# EAGLE schematic untitled (EAGLE 7.6.0)
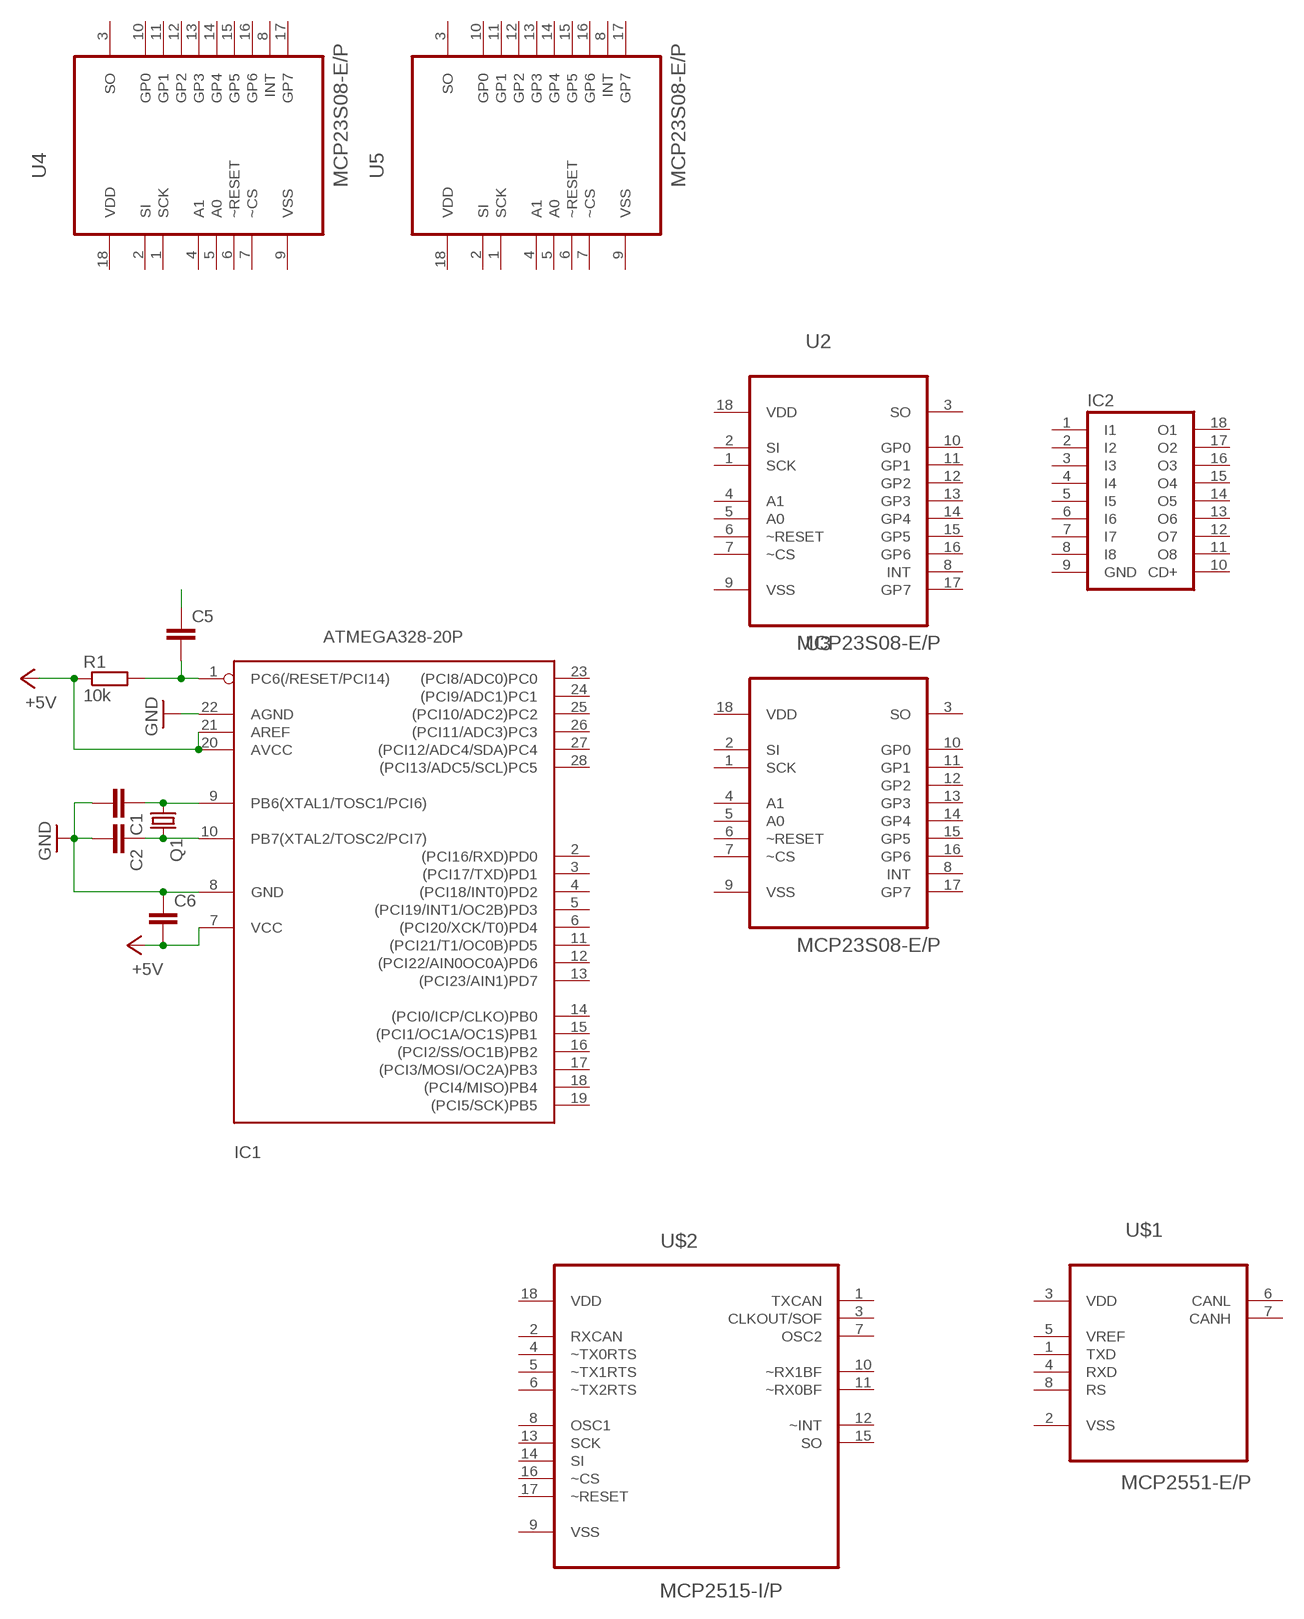
[diagram p0: schematic, sheet 1]

## Parts
C1  C5/3  [C5B3]
C2  C5/3  [C5B3]
C5  C5/3  [C5B3]
C6  C5/3  [C5B3]
IC1  ATMEGA328-20P  [DIL28-3]
IC2  ULN2803A  [DIL18]
Q1  CRYSTALHC18U-V  [HC18U-V]
R1  10k  R-EU_0207/12  [0207/12]
U2  MCP23S08-E/P  [DIP254P762X432-18]
U3  MCP23S08-E/P  [DIP254P762X432-18]
U4  MCP23S08-E/P  [DIP254P762X432-18]
U5  MCP23S08-E/P  [DIP254P762X432-18]
U$1  MCP2551-E/P  [DIP254P762X432-8]
U$2  MCP2515-I/P  [DIP254P762X432-18]

## Nets
+5V: C6.2 IC1.7(VCC) IC1.20(AVCC) IC1.21(AREF) R1.1
GND: C1.2 C2.2 C6.1 IC1.8(GND) IC1.22(AGND)
N$1: C1.1 IC1.9(PB6(XTAL1/TOSC1/PCI6)) Q1.1
N$2: C2.1 IC1.10(PB7(XTAL2/TOSC2/PCI7)) Q1.2
N$17: C5.1
N$18: C5.2 IC1.1(PC6(/RESET/PCI14)) R1.2
Unconnected: IC1.2((PCI16/RXD)PD0) IC1.3((PCI17/TXD)PD1) IC1.4((PCI18/INT0)PD2) IC1.5((PCI19/INT1/OC2B)PD3) IC1.6((PCI20/XCK/T0)PD4) IC1.11((PCI21/T1/OC0B)PD5) IC1.12((PCI22/AIN0OC0A)PD6) IC1.13((PCI23/AIN1)PD7) IC1.14((PCI0/ICP/CLKO)PB0) IC1.15((PCI1/OC1A/OC1S)PB1) IC1.16((PCI2/SS/OC1B)PB2) IC1.17((PCI3/MOSI/OC2A)PB3) IC1.18((PCI4/MISO)PB4) IC1.19((PCI5/SCK)PB5) IC1.23((PCI8/ADC0)PC0) IC1.24((PCI9/ADC1)PC1) IC1.25((PCI10/ADC2)PC2) IC1.26((PCI11/ADC3)PC3) IC1.27((PCI12/ADC4/SDA)PC4) IC1.28((PCI13/ADC5/SCL)PC5) IC2.1(I1) IC2.2(I2) IC2.3(I3) IC2.4(I4) IC2.5(I5) IC2.6(I6) IC2.7(I7) IC2.8(I8) IC2.10(CD+) IC2.11(O8) IC2.12(O7) IC2.13(O6) IC2.14(O5) IC2.15(O4) IC2.16(O3) IC2.17(O2) IC2.18(O1) U2.1(SCK) U2.2(SI) U2.3(SO) U2.4(A1) U2.5(A0) U2.6(~RESET) U2.7(~CS) U2.8(INT) U2.10(GP0) U2.11(GP1) U2.12(GP2) U2.13(GP3) U2.14(GP4) U2.15(GP5) U2.16(GP6) U2.17(GP7) U3.1(SCK) U3.2(SI) U3.3(SO) U3.4(A1) U3.5(A0) U3.6(~RESET) U3.7(~CS) U3.8(INT) U3.10(GP0) U3.11(GP1) U3.12(GP2) U3.13(GP3) U3.14(GP4) U3.15(GP5) U3.16(GP6) U3.17(GP7) U4.1(SCK) U4.2(SI) U4.3(SO) U4.4(A1) U4.5(A0) U4.6(~RESET) U4.7(~CS) U4.8(INT) U4.10(GP0) U4.11(GP1) U4.12(GP2) U4.13(GP3) U4.14(GP4) U4.15(GP5) U4.16(GP6) U4.17(GP7) U5.1(SCK) U5.2(SI) U5.3(SO) U5.4(A1) U5.5(A0) U5.6(~RESET) U5.7(~CS) U5.8(INT) U5.10(GP0) U5.11(GP1) U5.12(GP2) U5.13(GP3) U5.14(GP4) U5.15(GP5) U5.16(GP6) U5.17(GP7) U$1.1(TXD) U$1.2(VSS) U$1.4(RXD) U$1.5(VREF) U$1.6(CANL) U$1.7(CANH) U$1.8(RS) U$2.1(TXCAN) U$2.2(RXCAN) U$2.3(CLKOUT/SOF) U$2.4(~TX0RTS) U$2.5(~TX1RTS) U$2.6(~TX2RTS) U$2.7(OSC2) U$2.8(OSC1) U$2.10(~RX1BF) U$2.11(~RX0BF) U$2.12(~INT) U$2.13(SCK) U$2.14(SI) U$2.15(SO) U$2.16(~CS) U$2.17(~RESET)

## Power pins joined to a net without a drawn wire
GND: IC2.9(GND)
VDD: U2.18(VDD) U3.18(VDD) U4.18(VDD) U5.18(VDD) U$1.3(VDD) U$2.18(VDD)
VSS: U2.9(VSS) U3.9(VSS) U4.9(VSS) U5.9(VSS) U$2.9(VSS)

## Library data of the parts
C1 C2 C5 C6 = capacitor-wima:C: CAPACITOR naming: grid - package width
IC1 = atmega328:ATMEGA328*P: MICROCONTROLLER 32 kBytes FLASH 2 kBytes SRAM 1 kBytes EEPROM USART 8-channel 10 bit ADC
IC2 = uln-udn:ULN2803A: DRIVER ARRAY
Q1 = crystal:CRYSTAL: CRYSTAL; OC_FARNELL: unknown; OC_NEWARK: unknown
R1 = resistor:R-EU_: RESISTOR, European symbol
U2-U5 = Microchip_By_element14_Batch_1:MCP23S08-E/P: 8 Bit Expander; MPN: MCP23S08-E/P; OC_FARNELL: 1332091; OC_NEWARK: 08J8732; PACKAGE: DIP-18; SUPPLIER: Microchip
U$1 = Microchip_By_element14_Batch_1:MCP2551-E/P: High-Speed CAN Transceiver; MPN: MCP2551-E/P; OC_FARNELL: 1439745; OC_NEWARK: 69K7603; PACKAGE: DIP-8; SUPPLIER: Microchip
U$2 = Microchip_By_element14_Batch_1:MCP2515-I/P: Stand-Alone CAN Controller; DESCRIPTION: CAN CONTRL; MPN: MCP2515-I/P; OC_FARNELL: 1439391; OC_NEWARK: 61K2945; PACKAGE: PDIP-18; SUPPLIER: MICROCHIP

## Net classes
0 default: clearance 0.205 mm